# EAGLE design DC-DC_v3 (EAGLE 9.6.2)
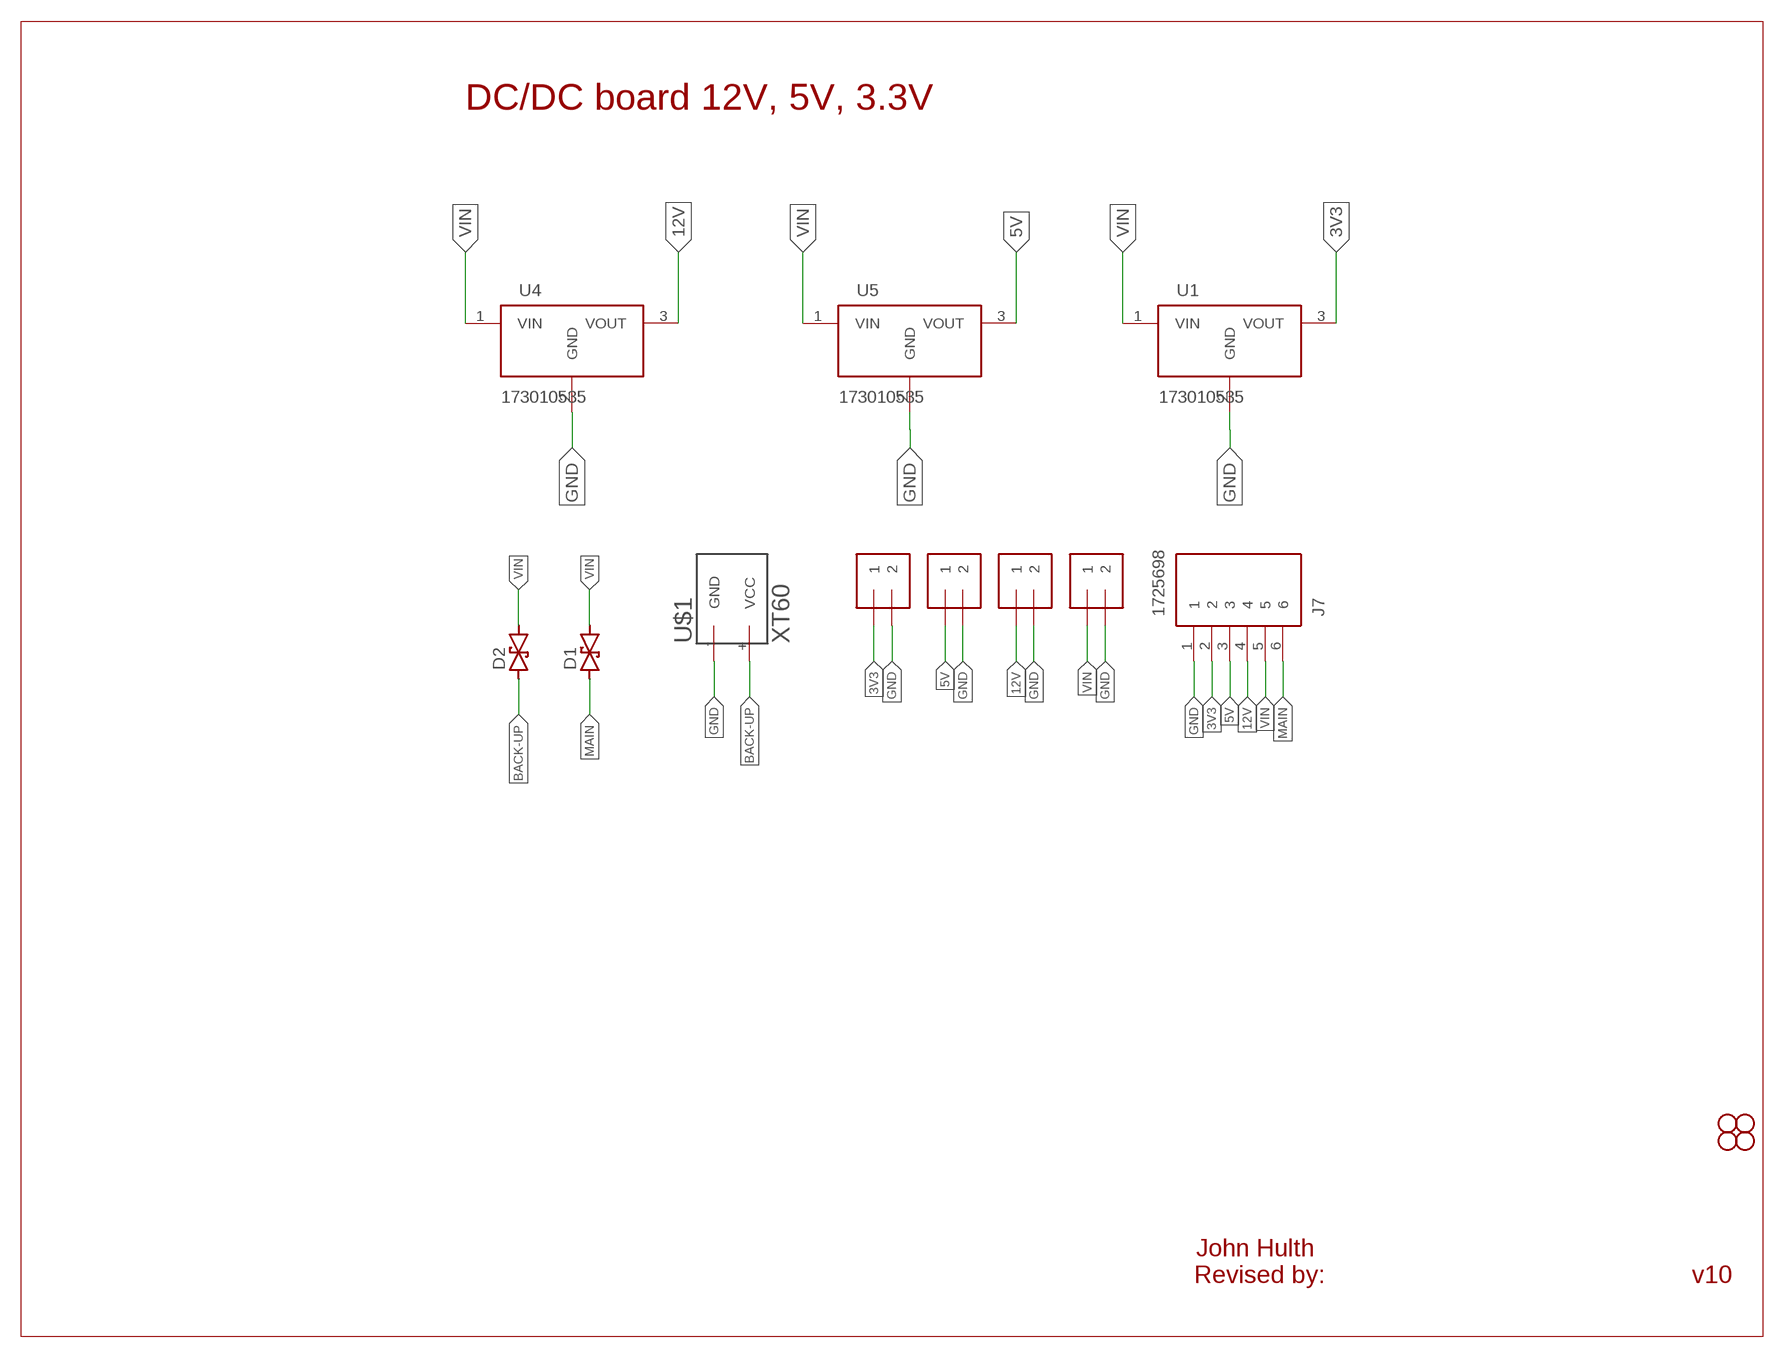
[diagram p0: schematic, sheet 1]

## Parts
D1  DIODE_SCHOTTKY2-P2-15  [P2-15]
D2  DIODE_SCHOTTKY2-P2-15  [P2-15]
J2  1X2-3.5MM  [1X2-3.5MM]
J3  1X2-3.5MM  [1X2-3.5MM]
J4  1X2-3.5MM  [1X2-3.5MM]
J5  1X2-3.5MM  [1X2-3.5MM]
J7  1725698  [SHDR6W90P0X254_1X6_1570X620X85]
JP2  STAND-OFF  [STAND-OFF]
JP3  STAND-OFF  [STAND-OFF]
JP8  STAND-OFF  [STAND-OFF]
JP9  STAND-OFF  [STAND-OFF]
U1  173010535  [173010535]
U4  173010535  [173010535]
U5  173010535  [173010535]
U$1  XT60  [XT60]

## Nets
3V3: J2.1 J7.2 U1.3(VOUT)
5V: J3.1 J7.3 U5.3(VOUT)
12V: J4.1 J7.4 U4.3(VOUT)
BACK-UP: D2.A U$1.+(VCC)
GND: J2.2 J3.2 J4.2 J5.2 J7.1 U1.2(GND) U4.2(GND) U5.2(GND) U$1.-(GND)
MAIN: D1.A J7.6
VIN: D1.C D2.C J5.1 J7.5 U1.1(VIN) U4.1(VIN) U5.1(VIN)

## Notes on the sheet
- DC/DC board 12V, 5V, 3.3V
- John Hulth
- Revised by: | v10

## Library data of the parts
D1 D2 = diode:DIODE_SCHOTTKY2-: Schottky Bidirectional Diode
J2-J5 = adafruit:1X2: 3.5mm Terminal block http://www.ladyada.net/library/pcb/eaglelibrary.html
J7 = 154N_NAU7802_TH:1725698: 6 way PCB vertical mount terminal,2.54mm 6 way PCB vertical mount terminal,2.54mm Source: Datasheet; ALLIED_NUMBER: 70054339; DESCRIPTION: 6 way PCB vertical mount terminal,2.54mm 6 way PCB vertical mount terminal,2.54mm; HEIGHT: 8.5mm; MANUFACTURER_NAME: Phoenix Contact; MANUFACTURER_PART_NUMBER: 1725698; RS_PART_NUMBER: 3909045; RS_PRICE-STOCK: https://uk.rs-online.com/web/p/products/3909045
JP2 JP3 JP8 JP9 = SparkFun:STAND-OFF: Stand Off This is the mechanical footprint for a #4 phillips button head screw. Use the keepout ring to avoid running the screw head into surrounding components. SKU : PRT-00447
U1 U4 U5 = DC-DC Converter:173010535: FDSM FIXED STEP DOWN REGULATOR M Manufacturer's datasheet <https://www.we-online.com/catalog/datasheet/173010335.pdf>; CREATED_BY: PCBLayout.com; DIGIKEY_PARTNO: 732-173010535-ND; MANUFACTURER: Würth Elektronik; MPN: 173010535
U$1 = XT60:XT60: XT60

## Board
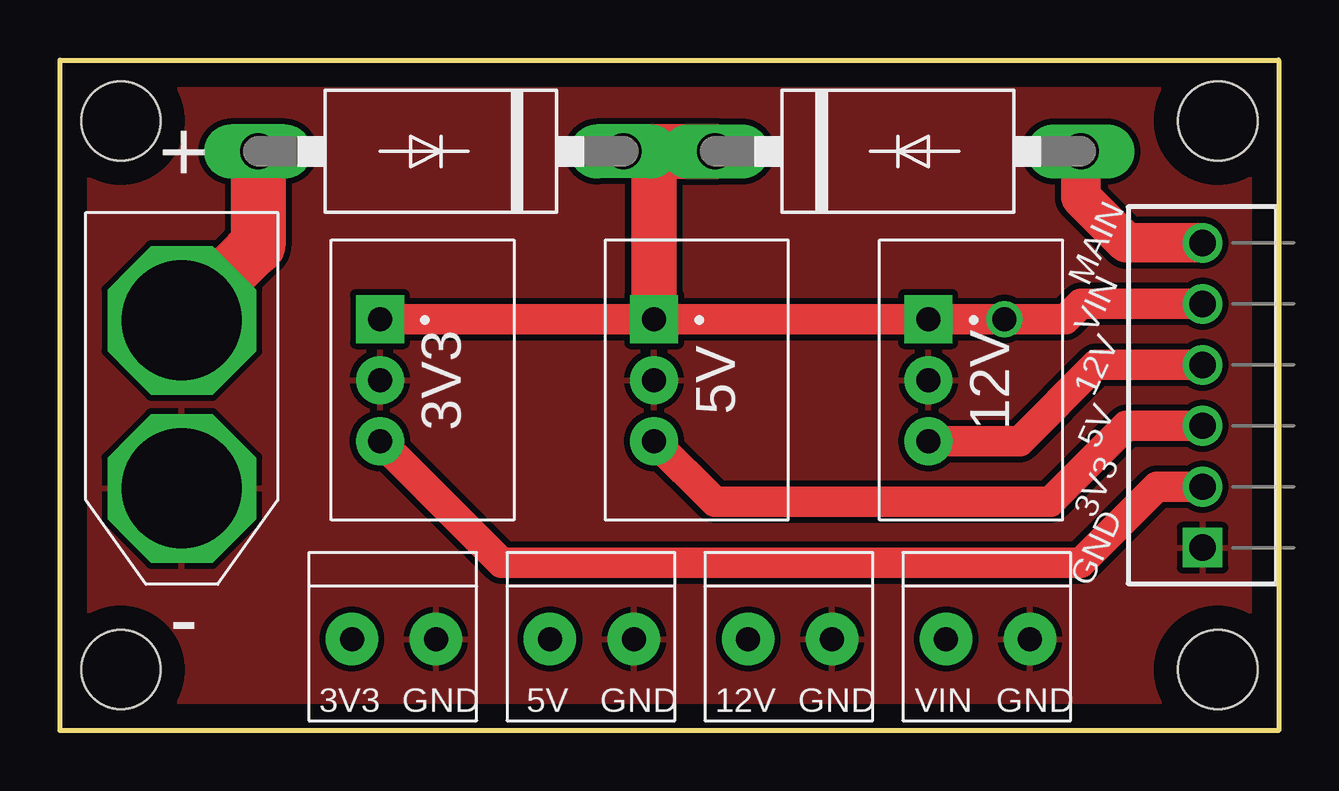
[diagram p1: board, top side]
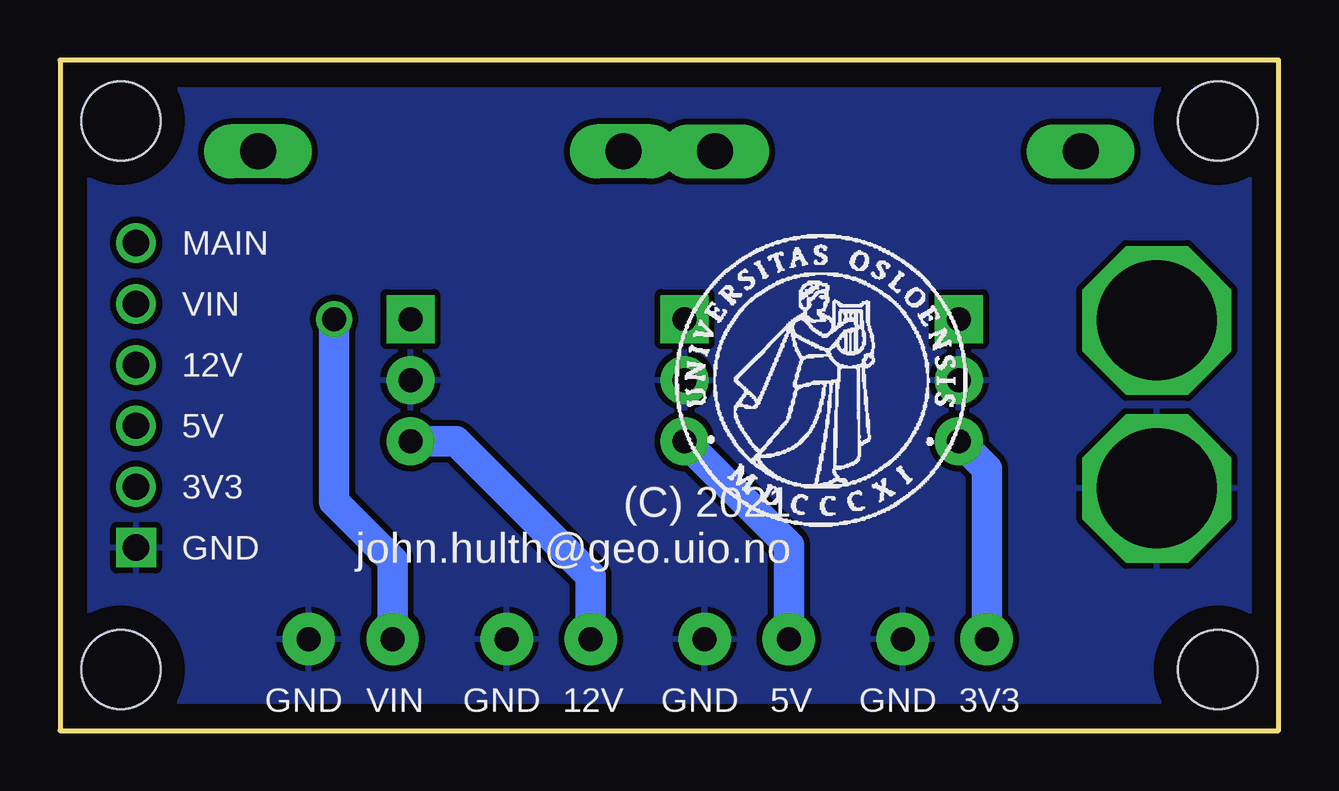
[diagram p2: board, bottom side, seen from below]

Size 50.8 x 27.94 mm. Coordinates in mm from the lower left corner, seen from the top.
Outline: 0,0 0,27.94 50.8,27.94 50.8,0 0,0
Copper layers (1*16): Top 0.035mm / dielectric 1.5mm / Bottom 0.035mm
Design rules "default": minimum track width 6mil, minimum drill 0.35mm, track to track 6mil, track to pad 6mil, pad to pad 6mil, via to via 6mil, smd to smd 6mil, copper to edge 40mil, drill to drill 6mil, minimum pad ring 10mil, minimum via ring 8mil, stop-mask expansion 4mil, vias tented up to drill 0mil, thermal gap 10mil

### Footprints (pad centres in the part's own frame; a part is rotated, then mirrored left to right if it is on the bottom)
P2-15 = drill 1.499 long: A 7.62,0; C -7.62,0
1X2-3.5MM = drill 1 pad 2.184: 1 1.8,0; 2 -1.7,0
SHDR6W90P0X254_1X6_1570X620X85 = drill 1.1 pad 1.65 square: 1 0,0 | drill 1.1 pad 1.65: 2 2.54,0; 3 5.08,0; 4 7.62,0; 5 10.16,0; 6 12.7,0
STAND-OFF = hole 3.302: 0,0
173010535 = drill 1 pad 2 square: 1 -2.54,0 | drill 1 pad 2: 2 0,0; 3 2.54,0
XT60 = drill 5 pad 6.2 octagon: + 4.5,0; - 11.5,0

### Placement (x,y rotation side)
D1  34.92,24.13 0 top
D2  15.88,24.13 180 top
J2  13.97,3.81 180 top
J3  22.23,3.81 180 top
J4  30.48,3.81 180 top
J5  38.73,3.81 180 top
J7  47.62,7.62 90 top
JP2  2.54,2.54 0 top
JP3  48.26,2.54 0 top
JP8  48.26,25.4 0 top
JP9  2.54,25.4 0 top
U1  13.34,14.61 270 top
U4  36.2,14.61 270 top
U5  24.77,14.61 270 top
U$1  5.08,21.59 270 top
U$3  [UIO-LOGO-BL]  25.4,8.26 0 bottom

### Tracks (layer width: path | path; a pad name or v marks a point on that pad's centre or on a via)
3V3
  Top 1.27: U1.3 18.41,6.99 42.55,6.99 45.72,10.16 J7.2
  Bottom 1.27: J2.1 12.17,10.9 U1.3
5V
  Top 1.27: U5.3 27.3,9.53 41.27,9.53 44.45,12.7 J7.3
  Bottom 1.27: J3.1 20.43,7.72 U5.3
12V
  Top 1.27: U4.3 40.01,12.06 43.18,15.24 J7.4
  Bottom 1.27: J4.1 28.68,6.46 34.29,12.06 U4.3
BACK-UP
  Top 2.286: D2.A 8.26,20.2 7.92,19.93 U$1.+
GND
  pour Top (isolate 0.254): 52.07,0 52.07,30.48 0,30.48 0,0
  pour Bottom (isolate 0.254): 51.44,0 51.44,31.11 0,31.11 0,0
MAIN
  Top 1.651: J7.6 44.45,20.32 42.55,22.23 D1.A
VIN  (via drill 1)
  Top 1.27: U1.1 U5.1 U4.1 v39.37,17.14 41.91,17.14 42.55,17.78 J7.5 | D2.C 24.77,24.13
  Top 1.905: U5.1 24.77,24.13
  Top 2.286: 24.77,24.13 D1.C
  Bottom 1.27: J5.1 36.94,7.09 39.37,9.53 v39.37,17.14

### Text on the board
tPlace: MAIN | VIN | 3V3 | 5V | 12V | 12V | 5V | 3V3 | GND | 3V3 | GND | 5V | GND | 12V | GND | VIN | GND
bPlace: MAIN | VIN | 12V | 5V | (C) 2021 / john.hulth@geo.uio.no | 3V3 | GND | 3V3 | GND | 5V | GND | 12V | GND | VIN | GND